# EAGLE design thumb-4.0-schematic (EAGLE 9.6.1)
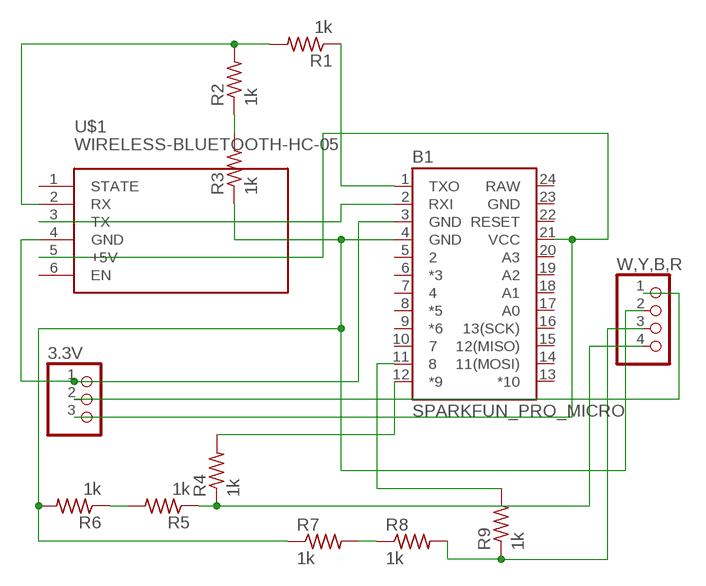
[diagram p0: schematic, sheet 1]

## Parts
3.3V  PINHD-1X3  [1X03]
B1  SPARKFUN_PRO_MICRO  [SPARKFUN_PRO_MICRO]
R1  1k  R-US_M1206  [M1206]
R2  1k  R-US_M1206  [M1206]
R3  1k  R-US_M1206  [M1206]
R4  1k  R-US_M1206  [M1206]
R5  1k  R-US_M1206  [M1206]
R6  1k  R-US_M1206  [M1206]
R7  1k  R-US_M1206  [M1206]
R8  1k  R-US_M1206  [M1206]
R9  1k  R-US_M1206  [M1206]
U$1  WIRELESS-BLUETOOTH-HC-05  [WIRELESS-BLUETOOTH-HC-05]
W,Y,B,R  PINHD-1X4  [1X04]

## Nets
N$1: 3.3V.1 B1.3(GND) U$1.4(GND)
N$2: 3.3V.3 B1.21(VCC) U$1.5(+5V)
N$3: R5.2 R6.1
N$4: B1.12(*9) R4.2
N$5: B1.11 R9.2
N$6: 3.3V.2 W,Y,B,R.1
N$7: B1.2(RXI) U$1.3(TX)
N$8: R4.1 R5.1 W,Y,B,R.4
N$9: B1.1(TXO) R1.1
N$10: R1.2 R2.2 U$1.2(RX)
N$11: R2.1 R3.2
N$12: R8.2 R9.1 W,Y,B,R.3
N$13: B1.4(GND) R3.1 R6.2 R7.1 W,Y,B,R.2
N$14: R7.2 R8.1
Unconnected: B1.5 B1.6(*3) B1.7 B1.8(*5) B1.9(*6) B1.10 B1.13(*10) B1.14(11(MOSI)) B1.15(12(MISO)) B1.16(13(SCK)) B1.17(A0) B1.18(A1) B1.19(A2) B1.20(A3) B1.22(RESET) U$1.1(STATE) U$1.6(EN)

## Power pins joined to a net without a drawn wire
GND: B1.23(GND)
RAW: B1.24(RAW)

## Library data of the parts
3.3V = pinhead:PINHD-1X3: PIN HEADER
B1 = SparkFun-Boards:SPARKFUN_PRO_MICRO: SparkFun Pro Micro Atmega32U4 compatible footprint. SparkFun Products: 3.3V/8MHz <https://www.sparkfun.com/products/12587> 5V/16MHz <https://www.sparkfun.com/products/12640>
R1-R6 = resistor:R-US_: RESISTOR, American symbol
R7-R9 = rcl:R-US_: RESISTOR, American symbol
U$1 = diy-modules:WIRELESS-BLUETOOTH-HC-05: Bluetooth Transceiver Module based on HC-05 board Tutorial is available here: https://arduino-info.wikispaces.com/BlueTooth-HC05-HC06-Modules-How-To Click here to find device on ebay.com <http://www.ebay.com/sch/hc-05+module+rs232>
W,Y,B,R = pinhead:PINHD-1X4: PIN HEADER

## Board
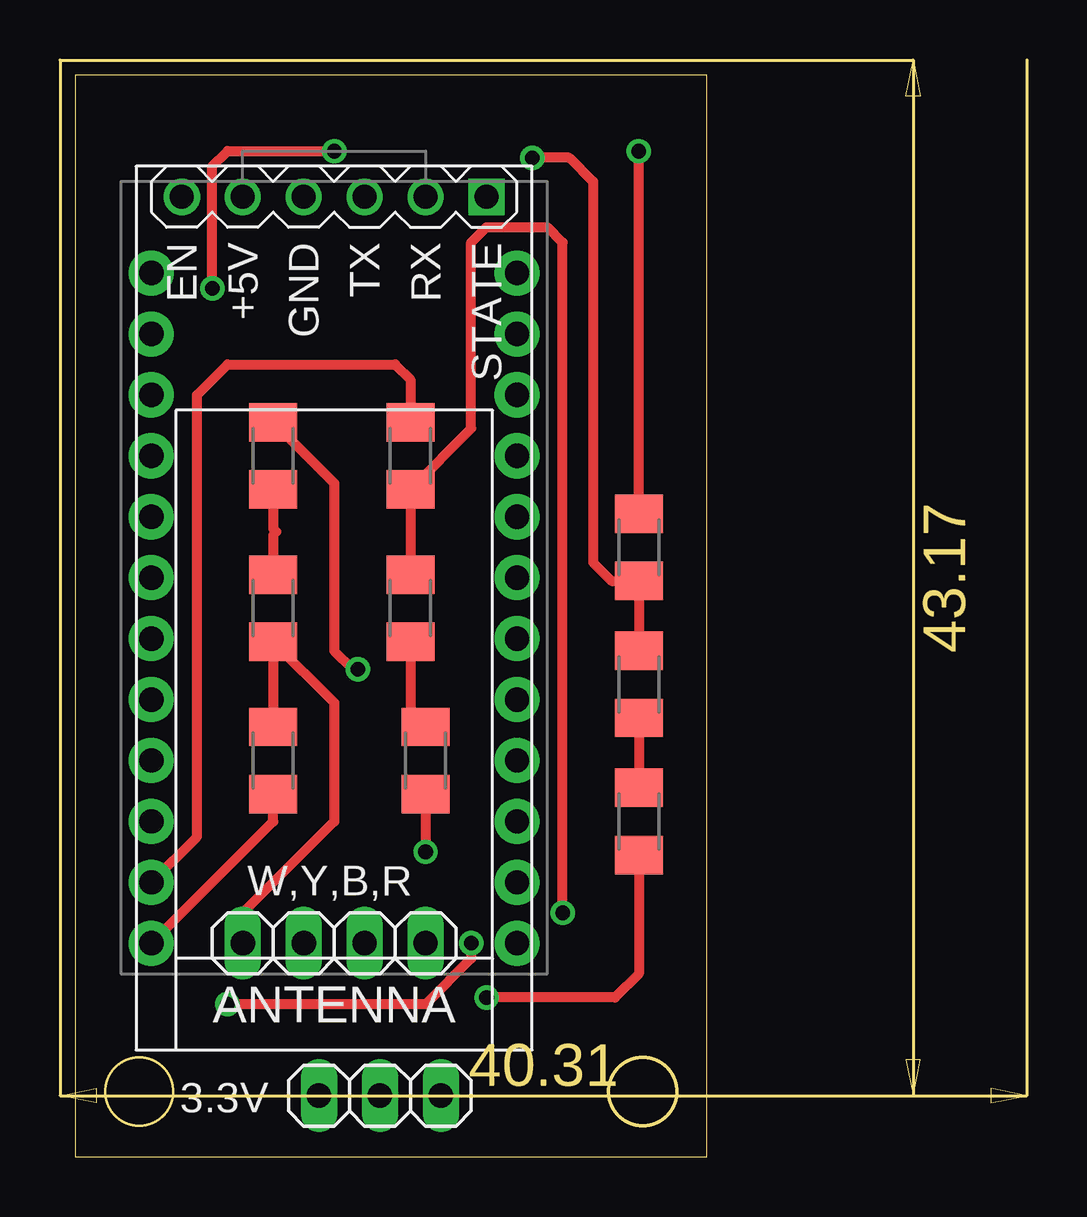
[diagram p1: board, top side]
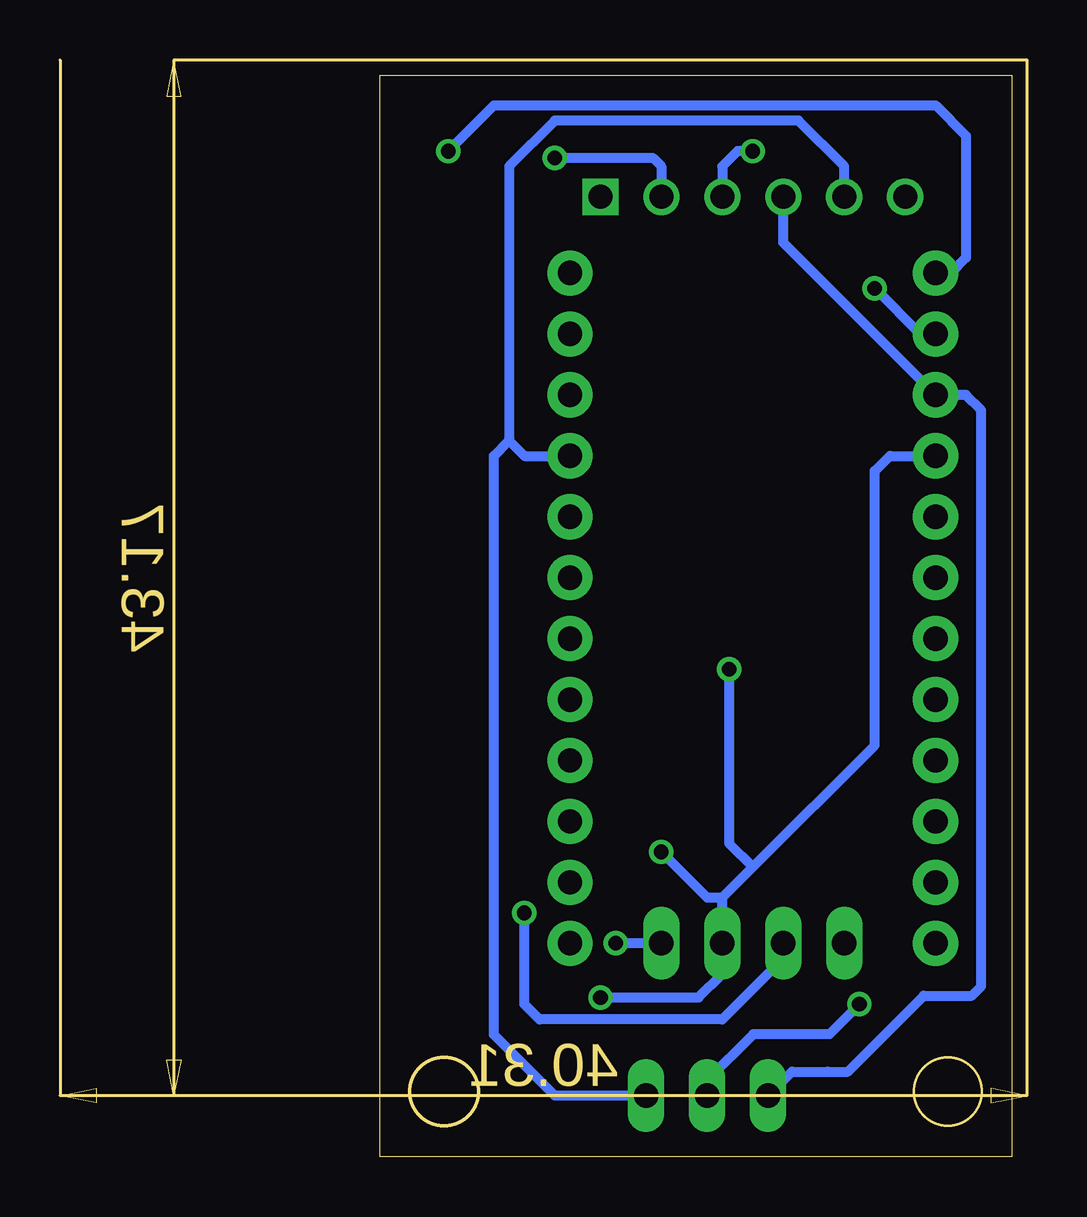
[diagram p2: board, bottom side, seen from below]

Size 26.34 x 45.07 mm. Coordinates in mm from the lower left corner, seen from the top.
Outline: 0,0 26.34,0 26.34,45.07 0,45.07 0,0
Outline: circle at 23.66,2.71 radius 1.41
Outline: circle at 2.66,2.71 radius 1.41
Copper layers (1*16): Top 0.035mm / dielectric 1.5mm / Bottom 0.035mm
Design rules "default": minimum track width 10mil, minimum drill 24mil, track to track 8mil, track to pad 8mil, pad to pad 8mil, via to via 8mil, smd to smd 8mil, copper to edge 40mil, drill to drill 8mil, minimum pad ring 10mil, minimum via ring 8mil, stop-mask expansion 4mil, vias tented up to drill 0mil, thermal gap 10mil

### Footprints (pad centres in the part's own frame; a part is rotated, then mirrored left to right if it is on the bottom)
1X03 = drill 1.016 long: 1 -2.54,0; 2 0,0; 3 2.54,0
SPARKFUN_PRO_MICRO = drill 1.016 pad 1.88: 1 -7.62,12.7; 2 -7.62,10.16; 3 -7.62,7.62; 4 -7.62,5.08; 5 -7.62,2.54; 6 -7.62,0; 7 -7.62,-2.54; 8 -7.62,-5.08; 9 -7.62,-7.62; 10 -7.62,-10.16; 11 -7.62,-12.7; 12 -7.62,-15.24; 13 7.62,-15.24; 14 7.62,-12.7; 15 7.62,-10.16; 16 7.62,-7.62; 17 7.62,-5.08; 18 7.62,-2.54; 19 7.62,0; 20 7.62,2.54; 21 7.62,5.08; 22 7.62,7.62; 23 7.62,10.16; 24 7.62,12.7
M1206 = smd 1.6 x 2: 1 -1.4,0; 2 1.4,0
WIRELESS-BLUETOOTH-HC-05 = drill 1 square: 1 -6.35,-17.145 | drill 1: 2 -3.81,-17.145; 3 -1.27,-17.145; 4 1.27,-17.145; 5 3.81,-17.145; 6 6.35,-17.145
1X04 = drill 1.016 long: 1 -3.81,0; 2 -1.27,0; 3 1.27,0; 4 3.81,0

### Placement (x,y rotation side)
3.3V  12.7,2.54 0 top
B1  10.79,24.13 0 top
R1  23.49,25.4 270 top
R2  23.49,19.69 90 top
R3  23.49,13.97 90 top
R4  8.25,16.51 270 top
R5  8.25,22.86 90 top
R6  8.25,29.21 90 top
R7  14.61,16.51 90 top
R8  13.97,22.86 90 top
R9  13.97,29.21 90 top
U$1  10.79,22.86 180 top
W,Y,B,R  10.79,8.89 180 top

### Tracks (layer width: path | path; a pad name or v marks a point on that pad's centre or on a via)
N$1
  Bottom 0.406: 3.3V.1 9.16,3.54 7.66,3.54 6.84,3.54 3.66,6.71 1.66,6.71 1.27,7.11 1.27,31.12 1.9,31.75 B1.3 9.52,38.1 U$1.4
N$2
  Bottom 0.406: U$1.5 6.98,41.27 8.89,43.18 19.05,43.18 20.95,41.27 20.95,29.85 | 20.95,29.85 20.32,29.21 B1.21 | 3.3V.3 19.05,2.54 21.59,5.08 21.59,29.21 20.95,29.85
N$3
  Top 0.406: R6.1 8.25,26.16 8.38,26.04 8.25,25.91 R5.2
N$4
  Top 0.406: B1.12 8.25,13.97 R4.2
N$5
  Top 0.406: B1.11 5.08,13.34 5.08,31.75 6.35,33.02 13.34,33.02 13.97,32.38 R9.2
N$6  (via drill 0.61)
  Top 0.406: v16.51,8.89 16.51,8.26 14.61,6.35 v6.35,6.35
  Bottom 0.406: W,Y,B,R.1 v16.51,8.89 | v6.35,6.35 7.59,5.11 10.77,5.11 12.7,3.18 3.3V.2
N$7  (via drill 0.61)
  Top 0.406: v10.79,41.91 6.35,41.91 5.71,41.27 v5.71,36.2
  Bottom 0.406: v5.71,36.2 3.81,34.29 B1.2 | v10.79,41.91 11.43,41.91 12.06,41.27 U$1.3
N$8
  Top 0.406: R4.1 R5.1 10.79,18.92 10.79,13.97 6.98,10.16 W,Y,B,R.4
N$9  (via drill 0.61)
  Top 0.406: R1.1 v23.49,41.91
  Bottom 0.406: B1.1 2.54,36.83 1.9,37.46 1.9,42.54 3.18,43.82 21.59,43.82 v23.49,41.91
N$10  (via drill 0.61)
  Top 0.406: 23.49,24.13 R1.2 | R1.2 R2.2 | v19.05,41.63 20.6,41.63 21.59,40.64 21.59,24.77 22.35,24 R1.2
  Bottom 0.406: v19.05,41.63 14.96,41.63 14.61,41.27 U$1.2
N$11
  Top 0.406: R2.1 R3.2
N$12  (via drill 0.61)
  Top 0.406: R8.2 R9.1 16.51,30.35 16.51,38.1 17.14,38.74 19.69,38.74 20.32,38.1 v20.32,10.16
  Bottom 0.406: W,Y,B,R.3 9.52,8.26 12.06,5.72 19.69,5.72 20.32,6.35 v20.32,10.16
N$13  (via drill 0.61)
  Top 0.406: R3.1 23.49,7.62 22.5,6.63 v17.14,6.63 | R6.2 10.79,28.07 10.79,21.09 11.56,20.32 v11.79,20.32 | R7.1 v14.61,12.7
  Bottom 0.406: B1.4 5.08,29.21 5.71,28.58 5.71,17.15 10.79,12.06 | 12.06,10.8 10.79,12.06 | W,Y,B,R.2 12.06,10.8 | v11.79,20.32 11.79,13.06 10.79,12.06 | 12.06,8.53 W,Y,B,R.2 | v14.61,12.7 12.7,10.8 12.06,10.8 | v17.14,6.63 13.06,6.63 12.06,7.62 W,Y,B,R.2
N$14
  Top 0.406: R8.1 13.97,18.55 R7.2